# EAGLE design schematic (EAGLE 9.5.0)
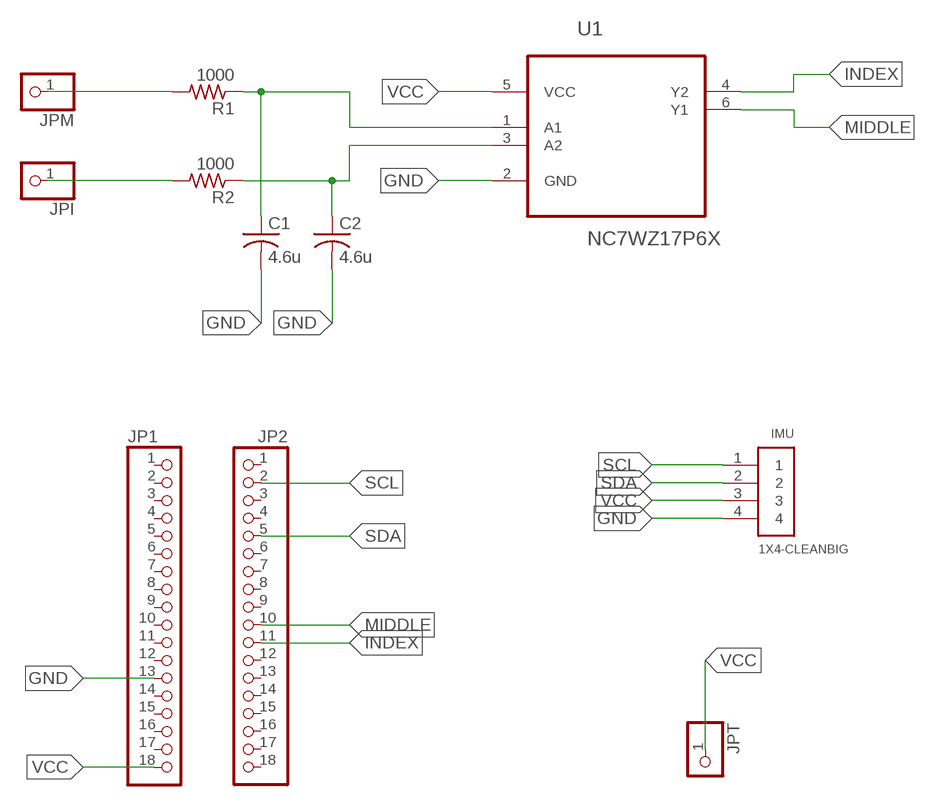
[diagram p0: schematic, sheet 1]

## Parts
C1  4.6u  C-USC0805  [C0805]
C2  4.6u  C-USC0805  [C0805]
IMU  1X4-CLEANBIG  [1X04-CLEANBIG]
JP1  PINHD-1X18-BIG  [1X18-BIG]
JP2  PINHD-1X18-BIG  [1X18-BIG]
JPI  PINHD-1X1CB  [1X01-CLEANBIG]
JPM  PINHD-1X1CB  [1X01-CLEANBIG]
JPT  PINHD-1X1CB  [1X01-CLEANBIG]
R1  1000  R-US_M0805  [M0805]
R2  1000  R-US_M0805  [M0805]
U1  NC7WZ17P6X  [SOT65P210X110-6N]

## Nets
GND: C1.2 C2.2 IMU.4 JP1.13 U1.2(GND)
INDEX: JP2.11 U1.4(Y2)
MIDDLE: JP2.10 U1.6(Y1)
N$3: C1.1 R1.1 U1.1(A1)
N$4: C2.1 R2.1 U1.3(A2)
N$5: JPM.1 R1.2
N$6: JPI.1 R2.2
SCL: IMU.1 JP2.2
SDA: IMU.2 JP2.5
VCC: IMU.3 JP1.18 JPT.1 U1.5(VCC)
Unconnected: JP1.1 JP1.2 JP1.3 JP1.4 JP1.5 JP1.6 JP1.7 JP1.8 JP1.9 JP1.10 JP1.11 JP1.12 JP1.14 JP1.15 JP1.16 JP1.17 JP2.1 JP2.3 JP2.4 JP2.6 JP2.7 JP2.8 JP2.9 JP2.12 JP2.13 JP2.14 JP2.15 JP2.16 JP2.17 JP2.18

## Library data of the parts
C1 C2 = adafruit:C-US: CAPACITOR, American symbol
IMU = adafruit:1X4: 4-pin connector
JP1 JP2 = adafruit:PINHD-1X18: PIN HEADER
JPI JPM JPT = adafruit:PINHD-1X1: Pin header 1x1 for 0.1" spacing With round pins
R1 R2 = adafruit:R-US_: RESISTOR, American symbol
U1 = NC7WZ17P6X:NC7WZ17P6X: Dual Buffer; DESCRIPTION: NC7WZ17 Series 5.5 V TinyLogic UHS Dual Buffer w/ Schmitt Trigger Inputs-SC-70-6; DIGI-KEY_PART_NUMBER: NC7WZ17P6XCT-ND; DIGI-KEY_PURCHASE_URL: https://www.digikey.com/product-detail/en/on-semiconductor/NC7WZ17P6X/NC7WZ17P6XCT-ND/965707?utm_source=snapeda&utm_medium=aggregator&utm_campaign=symbol; MF: ON Semiconductor; MP: NC7WZ17P6X; PACKAGE: SC-70-6 ON Semiconductor

## Board
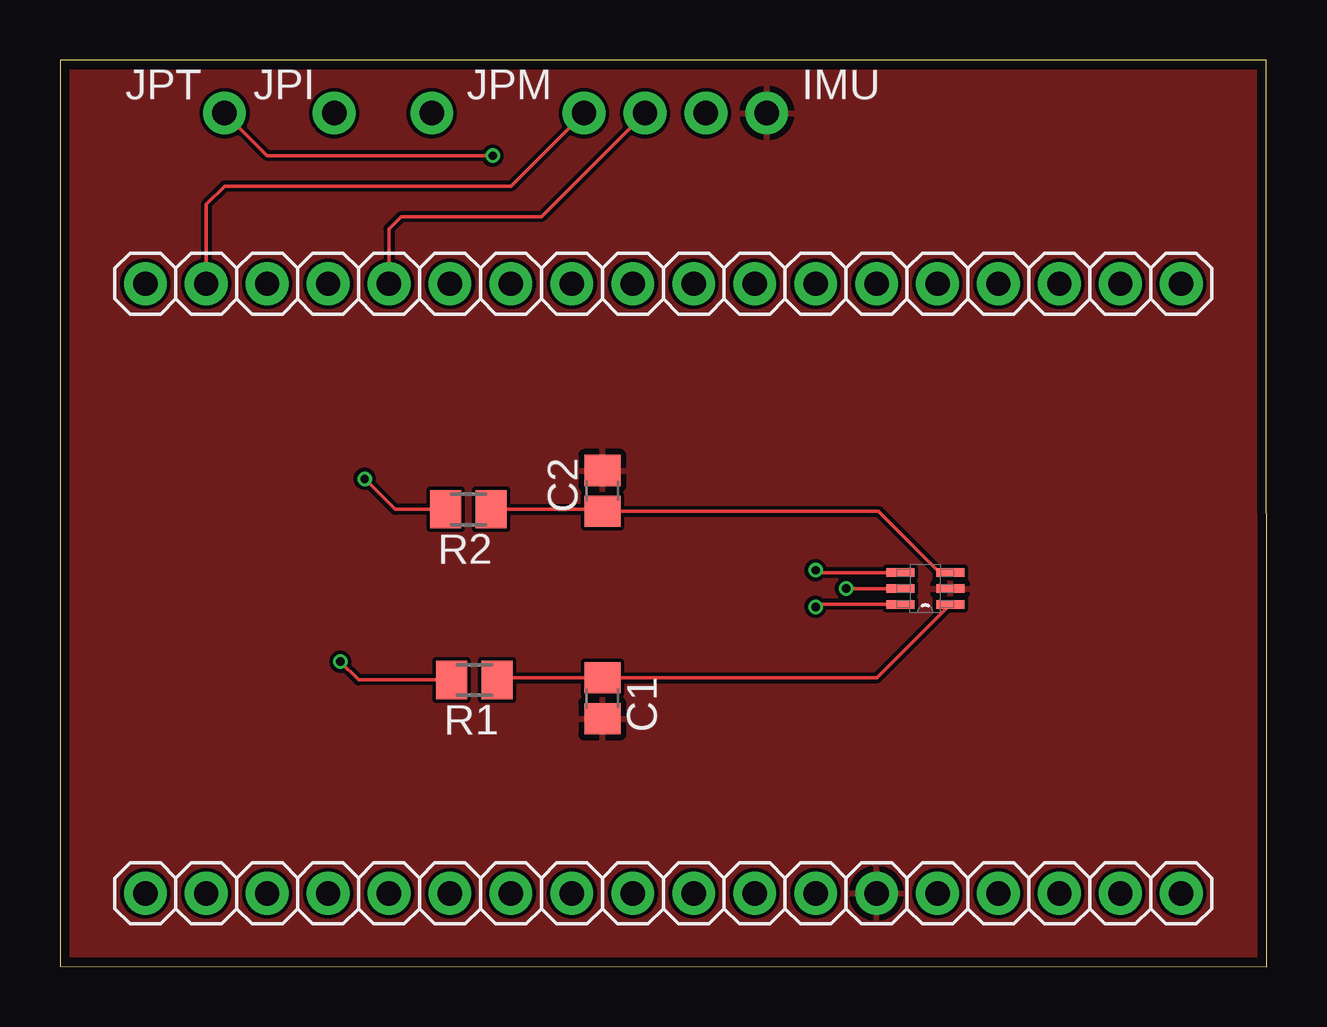
[diagram p1: board, top side]
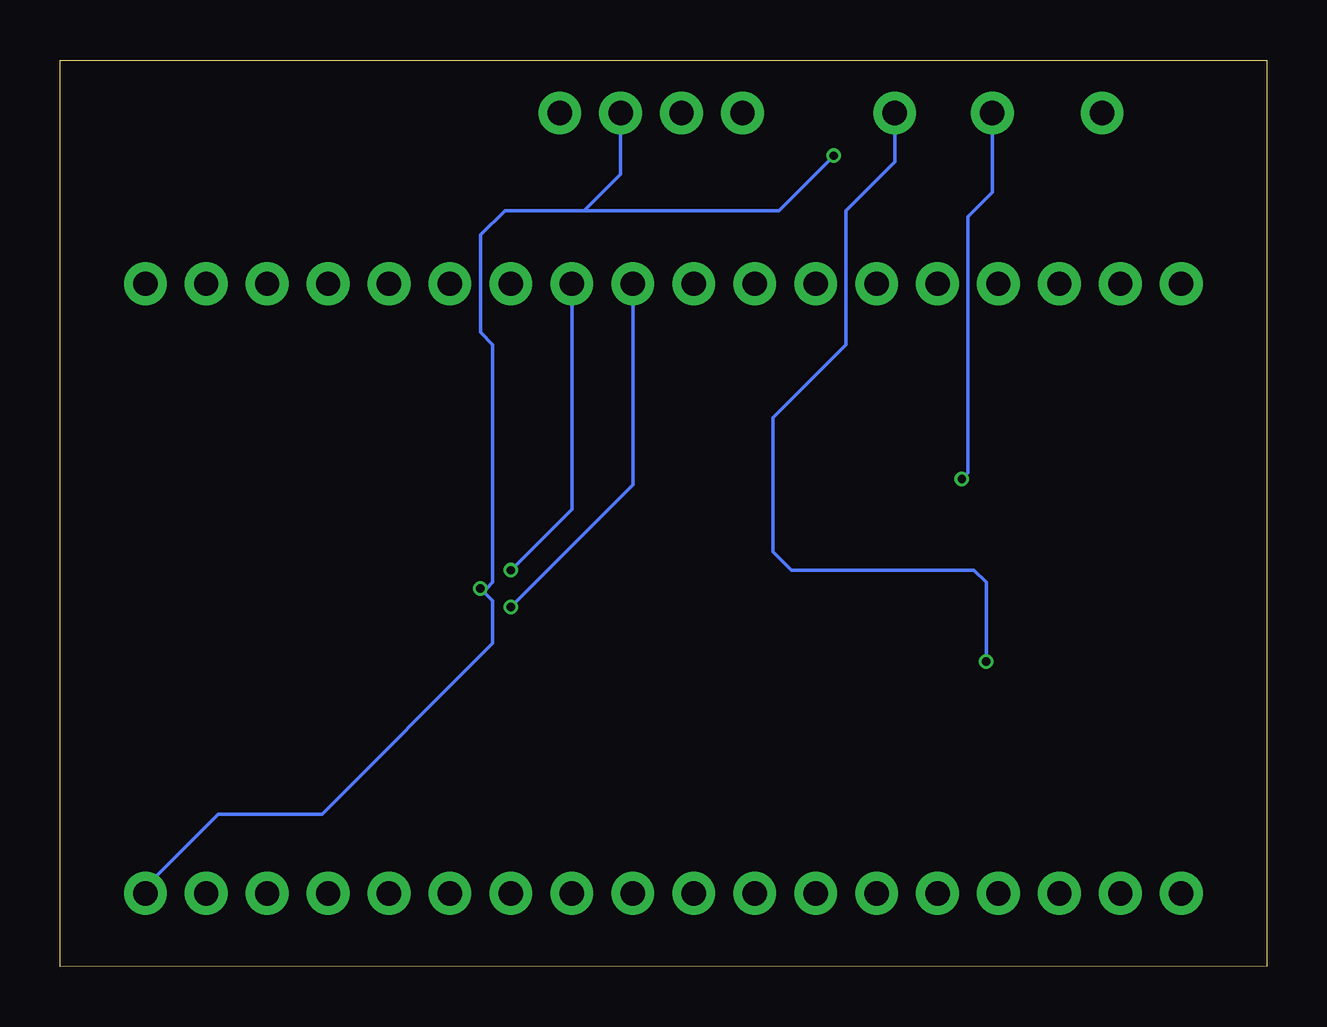
[diagram p2: board, bottom side, seen from below]

Size 50.29 x 37.79 mm. Coordinates in mm from the lower left corner, seen from the top.
Outline: 0,0.02 50.29,0 50.27,37.79 0,37.79 0,0.02
Copper layers (1*16): Top 0.035559375mm / dielectric 1.6mm / Bottom 0.035559375mm
Design rules "oshpark2layer": minimum track width 6mil, minimum drill 10mil, track to track 6mil, track to pad 6mil, pad to pad 6mil, via to via 6mil, smd to smd 6mil, copper to edge 15mil, drill to drill 6mil, minimum pad ring 5mil, minimum via ring 5mil, stop-mask expansion 2.5mil, vias tented up to drill 0mil, thermal gap 10mil

### Footprints (pad centres in the part's own frame; a part is rotated, then mirrored left to right if it is on the bottom)
C0805 = smd 1.3 x 1.5: 1 -0.85,0; 2 0.85,0
1X04-CLEANBIG = drill 1.016 pad 1.778: 1 -3.81,0; 2 -1.27,0; 3 1.27,0; 4 3.81,0
1X18-BIG = drill 1.016 pad 1.778: 1 -21.59,0; 2 -19.05,0; 3 -16.51,0; 4 -13.97,0; 5 -11.43,0; 6 -8.89,0; 7 -6.35,0; 8 -3.81,0; 9 -1.27,0; 10 1.27,0; 11 3.81,0; 12 6.35,0; 13 8.89,0; 14 11.43,0; 15 13.97,0; 16 16.51,0; 17 19.05,0; 18 21.59,0
1X01-CLEANBIG = drill 1.016 pad 1.778: 1 0,0
M0805 = smd 1.3 x 1.6: 1 -0.95,0; 2 0.95,0
SOT65P210X110-6N = smd 1.168 x 0.356: 1 -1.041,0.66; 2 -1.041,0; 3 -1.041,-0.66; 4 1.041,-0.66; 5 1.041,0; 6 1.041,0.66

### Placement (x,y rotation side)
C1  22.61,11.2 270 top
C2  22.61,19.83 90 top
IMU  25.65,35.58 0 top
JP1  25.15,3.07 0 top
JP2  25.15,28.47 0 top
JPI  11.43,35.58 0 top
JPM  15.49,35.58 0 top
JPT  6.86,35.58 0 top
R1  17.27,11.96 180 top
R2  17.02,19.07 180 top
U1  36.07,15.77 180 top

### Tracks (layer width: path | path; a pad name or v marks a point on that pad's centre or on a via)
GND
  pour Top: -2.79,40.15 -2.79,-3.54 54.86,-3.54 54.86,40.15
INDEX  (via drill 0.35)
  Top 0.152: U1.4 31.6,16.43 v31.5,16.53
  Bottom 0.152: v31.5,16.53 28.96,19.07 JP2.11
MIDDLE  (via drill 0.35)
  Top 0.152: U1.6 31.6,15.11 v31.5,15.01
  Bottom 0.152: v31.5,15.01 26.42,20.09 JP2.10
N$3
  Top 0.152: R1.1 18.31,12.05 C1.1 34.05,12.05 U1.1
N$4
  Top 0.152: R2.1 22.52,19.07 C2.1 34.12,18.98 36.68,16.43 U1.3
N$5  (via drill 0.35)
  Top 0.152: v11.68,12.72 12.45,11.96 R1.2
  Bottom 0.152: JPM.1 15.49,33.55 17.53,31.52 17.53,25.93 20.57,22.88 20.57,17.29 19.81,16.53 12.19,16.53 11.68,16.02 v11.68,12.72
N$6  (via drill 0.35)
  Top 0.152: R2.2 13.97,19.07 v12.7,20.34
  Bottom 0.152: v12.7,20.34 12.45,20.59 12.45,31.26 11.43,32.28 JPI.1
SCL
  Top 0.152: IMU.1 18.8,32.53 6.86,32.53 6.1,31.77 JP2.2
SDA
  Top 0.152: IMU.2 20.07,31.26 14.22,31.26 13.72,30.75 JP2.5
VCC  (via drill 0.35)
  Top 0.152: U1.5 v32.77,15.77 | v18.03,33.8 8.64,33.8 JPT.1
  Bottom 0.152: JP1.18 46.74,3.32 43.69,6.37 39.37,6.37 32.26,13.48 32.26,15.26 v32.77,15.77 32.51,15.77 32.26,16.02 32.26,25.93 32.77,26.44 32.77,30.5 31.75,31.52 28.7,31.52 28.45,31.52 | 28.45,31.52 26.92,33.04 IMU.3 | 28.45,31.52 20.32,31.52 v18.03,33.8